# Altium schematic sheet sar20-baseboard-SOM.SchDoc
size A3
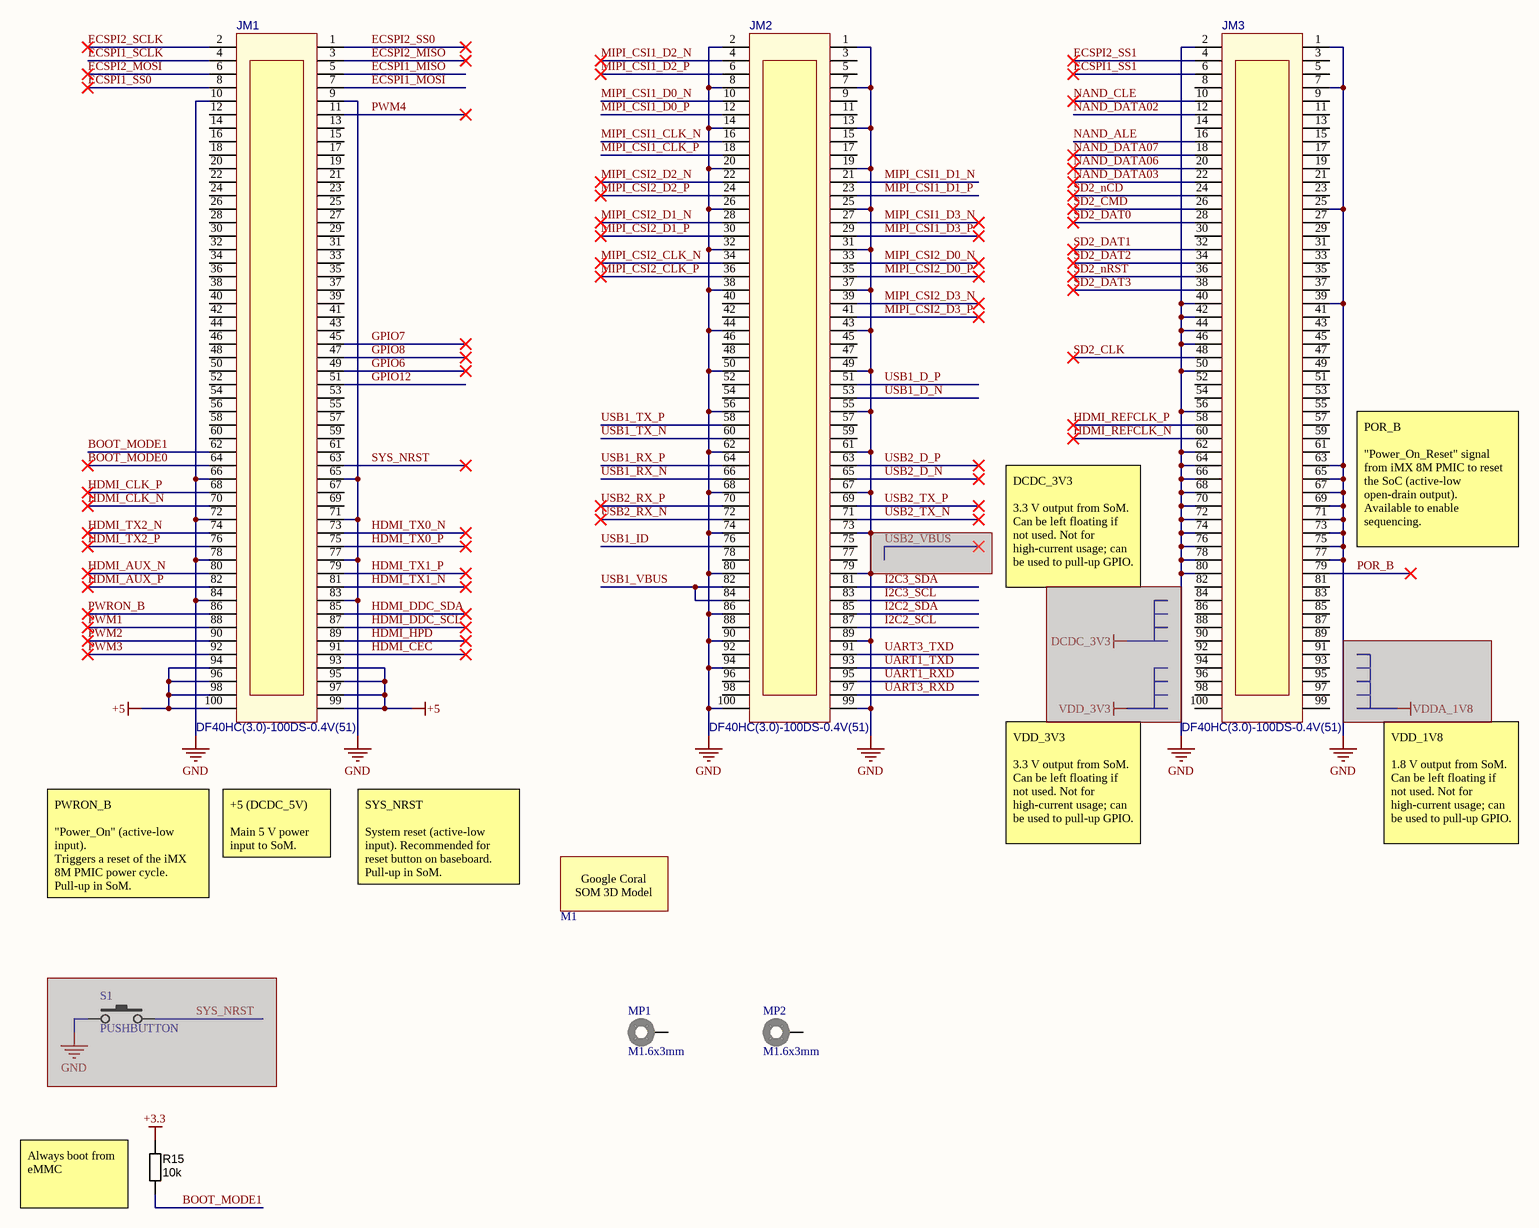
[diagram p0: sar20-baseboard-SOM.SchDoc]

## Parts
JM1  DF40HC(3.0)-100DS-0.4V(51)  [DF40HC(3.0)-100DS-0.4V(51)]
JM2  DF40HC(3.0)-100DS-0.4V(51)  [DF40HC(3.0)-100DS-0.4V(51)]
JM3  DF40HC(3.0)-100DS-0.4V(51)  [DF40HC(3.0)-100DS-0.4V(51)]
M1  Google Coral SOM  [CORAL-SOM]  (value not drawn)
MP1  M1.6x3mm  [9774030633]
MP2  M1.6x3mm  [9774030633]
R15  value 10k  [RESC1005X40N]  (hidden comment: Thick Film)
S1  PUSHBUTTON  [KMR421NGLFS]  (masked out: inside a compile mask, not in the netlist)

## Nets
+3.3: R15.1
+5: JM1.93(PB8) JM1.94(PB8) JM1.95(PB8) JM1.96(PB8) JM1.97(PB8) JM1.98(PB8) JM1.99(PB8) JM1.100(PB8)
GND: JM1.9(GND) JM1.10(PB15) JM1.65(PG6) JM1.66(BOOT1) JM1.71(PG12) JM1.72(PH12) JM1.77(GND) JM1.78(PI6) JM1.83(PB8) JM1.84(PB8) JM2.1(ETH_VDD) JM2.2 JM2.7(ETH_L1_C) JM2.8(GND) JM2.13(BATT_P) JM2.14(NRST) JM2.19(CHRG_NTC) JM2.20(PD14) JM2.25(PE8) JM2.26(PA8) JM2.31(PD5) JM2.32(PA10) JM2.37(PF0) JM2.38(PC11) JM2.43(PB3) JM2.44(PB4) JM2.49(PI2) JM2.50(BOOT0) JM2.55(PA11) JM2.56(PB7) JM2.61(PC7) JM2.62(PB12) JM2.67(PD3) JM2.68(PG11) JM2.73(PH13) JM2.74(PH8) JM2.79(PB8) JM2.80(ETH_R_N) JM2.86(PB8) JM2.89(PB8) JM2.90(PB8) JM2.94(PB8) JM2.99(PB8) JM2.100(PB8) JM3.1(ETH_VDD) JM3.2 JM3.7(ETH_L1_C) JM3.25(PE8) JM3.39(GND) JM3.40(PC12) JM3.42(PB10) JM3.44(PB4) JM3.46(PG9) JM3.50(BOOT0) JM3.56(PB7) JM3.62(PB12) JM3.63(PG7) JM3.64(GND) JM3.65(PG6) JM3.66(BOOT1) JM3.67(PD3) JM3.68(PG11) JM3.69(PG10) JM3.70(PH15) JM3.71(PG12) JM3.72(PH12) JM3.73(PH13) JM3.74(PH8) JM3.75(PH9) JM3.76(PI5) JM3.77(GND) JM3.78(PI6) JM3.80(ETH_R_N)
BOOT_MODE0: JM1.64(GND)
BOOT_MODE1: JM1.62(PB12) R15.2
ECSPI1_MISO: JM1.5(ETH_T_P)
ECSPI1_MOSI: JM1.7(ETH_L1_C)
ECSPI1_SCLK: JM1.4
ECSPI1_SS0: JM1.8(GND)
ECSPI1_SS1: JM3.6
ECSPI2_MISO: JM1.3(ETH_T_N)
ECSPI2_MOSI: JM1.6
ECSPI2_SCLK: JM1.2
ECSPI2_SS0: JM1.1(ETH_VDD)
ECSPI2_SS1: JM3.4
GPIO6: JM1.49(PI2)
GPIO7: JM1.45(PA14)
GPIO8: JM1.47(PA13)
GPIO12: JM1.51(PI3)
HDMI_AUX_N: JM1.80(ETH_R_N)
HDMI_AUX_P: JM1.82(PB8)
HDMI_CEC: JM1.91(PB8)
HDMI_CLK_N: JM1.70(PH15)
HDMI_CLK_P: JM1.68(PG11)
HDMI_DDC_SCL: JM1.87(PB8)
HDMI_DDC_SDA: JM1.85(PB8)
HDMI_HPD: JM1.89(PB8)
HDMI_REFCLK_N: JM3.60(PI1)
HDMI_REFCLK_P: JM3.58(PB5)
HDMI_TX0_N: JM1.73(PH13)
HDMI_TX0_P: JM1.75(PH9)
HDMI_TX1_N: JM1.81(PB8)
HDMI_TX1_P: JM1.79(PB8)
HDMI_TX2_N: JM1.74(PH8)
HDMI_TX2_P: JM1.76(PI5)
I2C2_SCL: JM2.87(PB8)
I2C2_SDA: JM2.85(PB8)
I2C3_SCL: JM2.83(PB8)
I2C3_SDA: JM2.81(PB8)
MIPI_CSI1_CLK_N: JM2.16(PE10)
MIPI_CSI1_CLK_P: JM2.18(PE9)
MIPI_CSI1_D0_N: JM2.10(PB15)
MIPI_CSI1_D0_P: JM2.12(PB14)
MIPI_CSI1_D1_N: JM2.21(1V8)
MIPI_CSI1_D1_P: JM2.23(PE7)
MIPI_CSI1_D2_N: JM2.4
MIPI_CSI1_D2_P: JM2.6
MIPI_CSI1_D3_N: JM2.27(PD1)
MIPI_CSI1_D3_P: JM2.29(PD0)
MIPI_CSI2_CLK_N: JM2.34(PC10)
MIPI_CSI2_CLK_P: JM2.36(PA15)
MIPI_CSI2_D0_N: JM2.33(PD4)
MIPI_CSI2_D0_P: JM2.35(PD7)
MIPI_CSI2_D1_N: JM2.28(GND)
MIPI_CSI2_D1_P: JM2.30(PA9)
MIPI_CSI2_D2_N: JM2.22(PD15)
MIPI_CSI2_D2_P: JM2.24(PC6)
MIPI_CSI2_D3_N: JM2.39(GND)
MIPI_CSI2_D3_P: JM2.41(RST_JTAG_O)
NAND_ALE: JM3.16(PE10)
NAND_CLE: JM3.10(PB15)
NAND_DATA02: JM3.12(PB14)
NAND_DATA03: JM3.22(PD15)
NAND_DATA06: JM3.20(PD14)
NAND_DATA07: JM3.18(PE9)
POR_B: JM3.79(PB8)
PWM1: JM1.88(PB8)
PWM2: JM1.90(PB8)
PWM3: JM1.92(PB8)
PWM4: JM1.11(BATT_P)
PWRON_B: JM1.86(PB8)
SD2_CLK: JM3.48(GND)
SD2_CMD: JM3.26(PA8)
SD2_DAT0: JM3.28(GND)
SD2_DAT1: JM3.32(PA10)
SD2_DAT2: JM3.34(PC10)
SD2_DAT3: JM3.38(PC11)
SD2_nCD: JM3.24(PC6)
SD2_nRST: JM3.36(PA15)
SYS_NRST: JM1.63(PG7)
UART1_RXD: JM2.95(PB8)
UART1_TXD: JM2.93(PB8)
UART3_RXD: JM2.97(PB8)
UART3_TXD: JM2.91(PB8)
USB1_D_N: JM2.53(PA12)
USB1_D_P: JM2.51(PI3)
USB1_ID: JM2.76(PI5)
USB1_RX_N: JM2.66(BOOT1)
USB1_RX_P: JM2.64(GND)
USB1_TX_N: JM2.60(PI1)
USB1_TX_P: JM2.58(PB5)
USB1_VBUS: JM2.82(PB8) JM2.84(PB8)
USB2_D_N: JM2.65(PG6)
USB2_D_P: JM2.63(PG7)
USB2_RX_N: JM2.72(PH12)
USB2_RX_P: JM2.70(PH15)
USB2_TX_N: JM2.71(PG12)
USB2_TX_P: JM2.69(PG10)

Not connected (* = marked no-connect by the designer): JM1 12(PB14) 13(BATT_P) 14(NRST) 15(USB_VBUS) 16(PE10) 17(USB_VBUS) 18(PE9) 19(CHRG_NTC) 20(PD14) 21(1V8) 22(PD15) 23(PE7) 24(PC6) 25(PE8) 26(PA8) 27(PD1) 28(GND) 29(PD0) 30(PA9) 31(PD5) 32(PA10) 33(PD4) 34(PC10) 35(PD7) 36(PA15) 37(PF0) 38(PC11) 39(GND) 40(PC12) 41(RST_JTAG_O) 42(PB10) 43(PB3) 44(PB4) 46(PG9) 48(GND) 50(BOOT0) 52(PC8) 53(PA12) 54(PB6) 55(PA11) 56(PB7) 57(PI0) 58(PB5) 59(PD6) 60(PI1) 61(PC7) 67(PD3) 69(PG10); JM2 3(ETH_T_N) 5(ETH_T_P) 9(GND) 11(BATT_P) 15(USB_VBUS) 17(USB_VBUS) 40(PC12) 42(PB10) 45(PA14) 46(PG9) 47(PA13) 48(GND) 52(PC8) 54(PB6) 57(PI0) 59(PD6) 75(PH9) 77(GND) 78(PI6) 88(PB8) 92(PB8) 96(PB8) 98(PB8); JM3 3(ETH_T_N) 5(ETH_T_P) 8(GND) 9(GND) 11(BATT_P) 13(BATT_P) 14(NRST) 15(USB_VBUS) 17(USB_VBUS) 19(CHRG_NTC) 21(1V8) 23(PE7) 27(PD1) 29(PD0) 30(PA9) 31(PD5) 33(PD4) 35(PD7) 37(PF0) 41(RST_JTAG_O) 43(PB3) 45(PA14) 47(PA13) 49(PI2) 51(PI3) 52(PC8) 53(PA12) 54(PB6) 55(PA11) 57(PI0) 59(PD6) 61(PC7) 81(PB8) 82(PB8) 83(PB8) 84(PB8) 85(PB8) 86(PB8) 87(PB8) 88(PB8) 89(PB8) 90(PB8) 91(PB8) 92(PB8) 93(PB8) 94(PB8) 95(PB8) 96(PB8) 97(PB8) 98(PB8) 99(PB8) 100(PB8); MP1 1; MP2 1

## Notes on the sheet
- DCDC_3V3
  3.3 V output from SoM. Can be left floating if not used. Not for high-current usage; can be used to pull-up GPIO.
- POR_B
  "Power_On_Reset" signal from iMX 8M PMIC to reset the SoC (active-low open-drain output).
  Available to enable sequencing.
- +5 (DCDC_5V)
  Main 5 V power input to SoM.
  Must be connected.
- VDD_3V3
  3.3 V output from SoM. Can be left floating if not used. Not for high-current usage; can be used to pull-up GPIO.
- VDD_1V8
  1.8 V output from SoM. Can be left floating if not used. Not for high-current usage; can be used to pull-up GPIO.
- PWRON_B
  "Power_On" (active-low input).
  Triggers a reset of the iMX 8M PMIC power cycle. Pull-up in SoM.
- SYS_NRST
  System reset (active-low input). Recommended for reset button on baseboard.
  Pull-up in SoM.
- (near R15) Always boot from eMMC
- (in symbol CORAL-SOM-3D-MODEL) Google Coral SOM 3D Model

## Library data of the parts
JM1-JM3 = DF40HC(3.0)-100DS-0.4V(51): CONN RCPT 100POS 0.4MM SMD GOLD; Manufacturer: Hirose; PartNumber: DF40HC(3.0)-100DS-0.4V(51); Value: DF40HC(3.0)-100DS-0.4V(51)
M1 = CORAL-SOM-3D-MODEL
MP1 MP2 = 9774030633: WA-SMSI SMT Steel Spacer, M1.6 Thread Internal, OD 3.3mm, M1.6x3mm; Manufacturer: Wurth Elektronik; Inner Diameter: 1.9mm; Surface: Tin; ComponentLink1Description: Manufacturer; ComponentLink1URL: http://www.we-online.de; ComponentLink2Description: Datasheet; ComponentLink2URL: https://www.we-online.com/catalog/datasheet/9774030633.pdf; Mounting Technology: SMT; Packaging: Bulk; Manufacturer Part Number: 9774030633; Length: 3mm; Inner Thread Length: -; Operating Temperature: -55 to +150degC; Outer Diameter: 3.3mm; Published Date: April 2020; Material: Steel; Thread: M1.6
R15 = RES_10K_0402_1%: Resistor SMD chip 10k Ohm 0.063W 1% 0402; Manufacturer 1: Vishay Dale; Manufacturer Part Number 1: CRCW040210K0FKED; Ratings: 1/16 W; SCDType: spec; Package / Case: 0402 (1005 Metric); Manufacturer 2: Yageo; Manufacturer Part Number 2: RC0402FR-0710KL; Supplier 1: Digi-Key; Supplier Part Number 1: 541-10.0KLCT-ND; ComponentLink1URL: http://www.vishay.com/doc?20035; ComponentLink1Description: http://www.vishay.com/doc?20035; Supplier 2: Digi-Key; Supplier Part Number 2: 311-10.0KLRCT-ND; ComponentLink2URL: http://www.yageo.com/documents/recent/PYu-RC0402_51_RoHS_L_6.pdf; ComponentLink2Description: http://www.yageo.com/documents/recent/PYu-RC0402_51_RoHS_L_6.pdf; Tolerance: ±1%